# Altium schematic sheet Sheet1.SchDoc
size A4; SheetNumber: 1; SheetTotal: 1
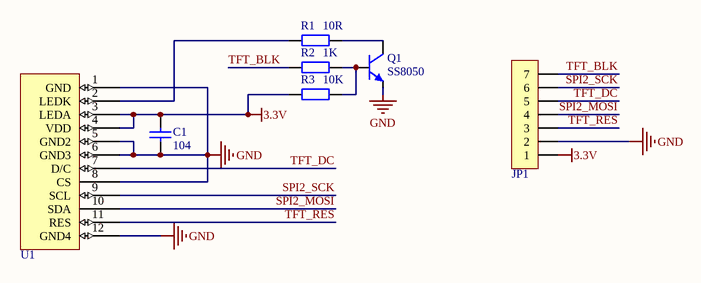
[diagram p0: Sheet1.SchDoc]

## Parts
C1  104  [C 0603_L]
JP1  HDR-1X7  [HDR2.54-M-LI-7P]  (value not drawn)
Q1  SS8050  [SOT23-3N]
R1  10R  [R 0603_L]
R2  1K  [R 0603_L]
R3  10K  [R 0603_L]
U1  TFT-1.3  [TFT-1.3]  (value not drawn)

## Nets
3.3V: C1.1 JP1.1 R3.2 U1.3(LEDA) U1.4(VDD)
GND: C1.2 JP1.2 Q1.2(E) U1.1(GND) U1.5(GND2) U1.6(GND3) U1.8(CS) U1.12(GND4)
SPI2_MOSI: JP1.4 U1.10(SDA)
SPI2_SCK: JP1.6 U1.9(SCL)
TFT_BLK: JP1.7 R2.1
TFT_DC: JP1.5 U1.7(D/C)
TFT_RES: JP1.3 U1.11(RES)
NetQ1_1: Q1.1(B) R2.2 R3.1
NetQ1_3: Q1.3(C) R1.1
NetR1_2: R1.2 U1.2(LEDK)

## Library data of the parts
C1 = C: 贴片电容; BOM名称: 无极性贴片电容; 联系卖家，免费查找封装: 唯一出售店铺网址https://shop463601444.taobao.com; 封装库来自淘宝卖家ID：黄晶宝石: 其他店铺购入均为盗版假冒封装库
JP1 = Header 7: 7P接插件; 封装库来自淘宝卖家 ID：黄晶宝石: 其他店铺购入均为盗版假冒封装库; 联系卖家，免费查找封装: 唯一出售店铺网址https://shop463601444.taobao.com; BOM名称: 7P接插件
Q1 = 8050-SMD: 高频放大-NPN型; B属性: 40V 1.5A 1W 100MHZ; 联系卖家，免费查找封装: 唯一出售店铺网址https://shop463601444.taobao.com; BOM名称: 高频放大-NPN型
R1-R3 = R: 贴片电阻; 联系卖家，免费查找封装: 唯一出售店铺网址https://shop463601444.taobao.com; 封装库来自淘宝卖家ID：黄晶宝石: 其他店铺购入均为盗版假冒封装库; BOM名称: 贴片电阻